# EAGLE design voltage_regulator_board (EAGLE 7.7.0)
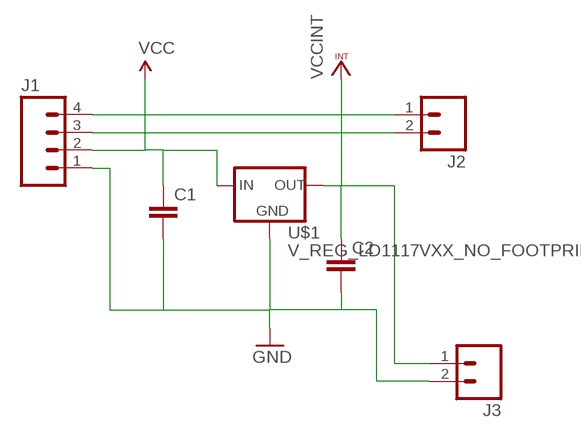
[diagram p0: schematic, sheet 1]

## Parts
C1  CAP0805  [0805]
C2  CAP0805  [0805]
J1  M04LOCK  [1X04_LOCK]
J2  M02LOCK  [1X02_LOCK]
J3  M02LOCK  [1X02_LOCK]
U$1  V_REG_LD1117VXX_NO_FOOTPRINT  [TO-220-NOFOOTPRINT]

## Nets
GND: C1.2 C2.2 J1.1 J3.2 U$1.GND
N$1: J1.4 J2.1
N$2: J1.3 J2.2
VCC: C1.1 J1.2 U$1.IN
VCCINT: C2.1 J3.1 U$1.OUT

## Library data of the parts
C1 C2 = SparkFun-Capacitors:CAP: Capacitor Standard 0603 ceramic capacitor, and 0.1" leaded capacitor.
J1 = SparkFun-Connectors:M04: Header 4 Standard 4-pin 0.1" header. Use with straight break away headers (SKU : PRT-00116), right angle break away headers (PRT-00553), swiss pins (PRT-00743), machine pins (PRT-00117), and female headers (PRT-00115). Molex polarized connector foot print use with SKU : PRT-08231 with associated crimp pins and housings. 1MM SMD Version SKU: PRT-10208; PROD_ID: CONN-09696
J2 J3 = SparkFun-Connectors:M02: Standard 2-pin 0.1" header. Use with - straight break away headers ( PRT-00116) - right angle break away headers (PRT-00553) - swiss pins (PRT-00743) - machine pins (PRT-00117) - female headers (PRT-00115) Molex polarized connector foot print use with: PRT-08233 with associated crimp pins and housings. 2.54_SCREWTERM for use with PRT-10571. 3.5mm Screw Terminal footprints for PRT-08084 5mm Screw Terminal footprints for use with PRT-08432
U$1 = SparkFun-PowerIC:V_REG_LD1117VXX_NO_FOOTPRINT: LD1117VXX voltage regulator. We carry the 3.3V version (COM-00526) in TO-220 package.

## Board
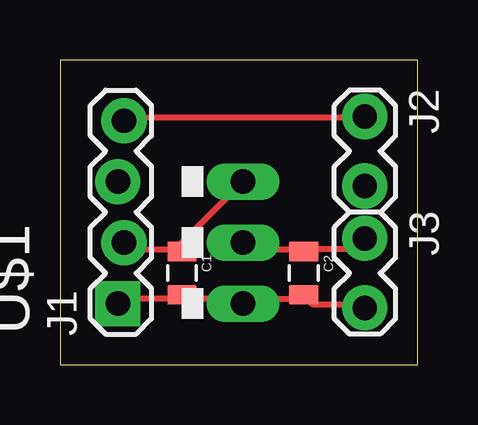
[diagram p1: board, top side]
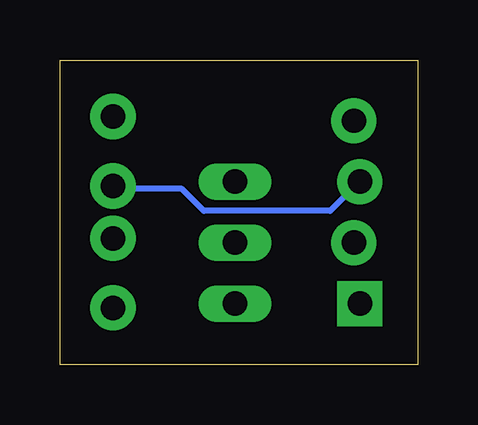
[diagram p2: board, bottom side, seen from below]

Size 14.91 x 12.69 mm. Coordinates in mm from the lower left corner, seen from the top.
Outline: 0,0 14.91,0 14.91,12.69 0,12.69 0,0
Copper layers (1*16): Top 0.035mm / dielectric 1.5mm / Bottom 0.035mm
Design rules "default": minimum track width 10mil, minimum drill 24mil, track to track 8mil, track to pad 8mil, pad to pad 8mil, via to via 8mil, smd to smd 8mil, copper to edge 40mil, drill to drill 8mil, minimum pad ring 10mil, minimum via ring 8mil, stop-mask expansion 4mil, vias tented up to drill 0mil, thermal gap 10mil

### Footprints (pad centres in the part's own frame; a part is rotated, then mirrored left to right if it is on the bottom)
0805 = smd 0.8 x 1.2: 1 -0.9,0; 2 0.9,0
1X04_LOCK = drill 1.016 pad 1.88 square: 1 0,0.127 | drill 1.016 pad 1.88: 2 2.54,-0.127; 3 5.08,0.127; 4 7.62,-0.127
1X02_LOCK = drill 1.016 pad 1.88: 1 -0.178,0; 2 2.718,0
TO-220-NOFOOTPRINT = drill 1.016 long: GND -2.54,-3.81; IN 2.54,-3.81; OUT 0,-3.81

### Placement (x,y rotation side)
C1  5.08,3.81 270 top
C2  10.16,3.81 270 top
J1  2.54,2.54 90 top
J2  12.7,10.16 270 top
J3  12.7,5.08 270 top
U$1  3.81,5.08 90 top

### Tracks (layer width: path | path; a pad name or v marks a point on that pad's centre or on a via)
GND
  Top 0.254: J3.2 12.57,2.52 10.52,2.52 10.29,2.74 C2.2 10.06,2.74 7.77,2.74 U$1.GND 7.54,2.74 5.26,2.74 C1.2 5.03,2.74 2.52,2.74 J1.1
N$1
  Top 0.254: J1.4 2.74,10.29 12.57,10.29 J2.1
N$2
  Bottom 0.254: J2.2 12.57,7.32 9.83,7.32 8.91,6.4 3.66,6.4 2.52,7.54 J1.3
VCC
  Top 0.254: 4.8,4.8 2.97,4.8 2.74,5.03 J1.2 | 4.8,4.8 5.03,4.8 C1.1 4.8,4.8 | 4.8,4.8 U$1.IN
VCCINT
  Top 0.254: U$1.OUT 7.77,5.03 8,4.8 10.06,4.8 C2.1 10.29,4.8 12.12,4.8 12.57,5.26 J3.1